# EAGLE schematic Radarv3 (EAGLE 6.3)
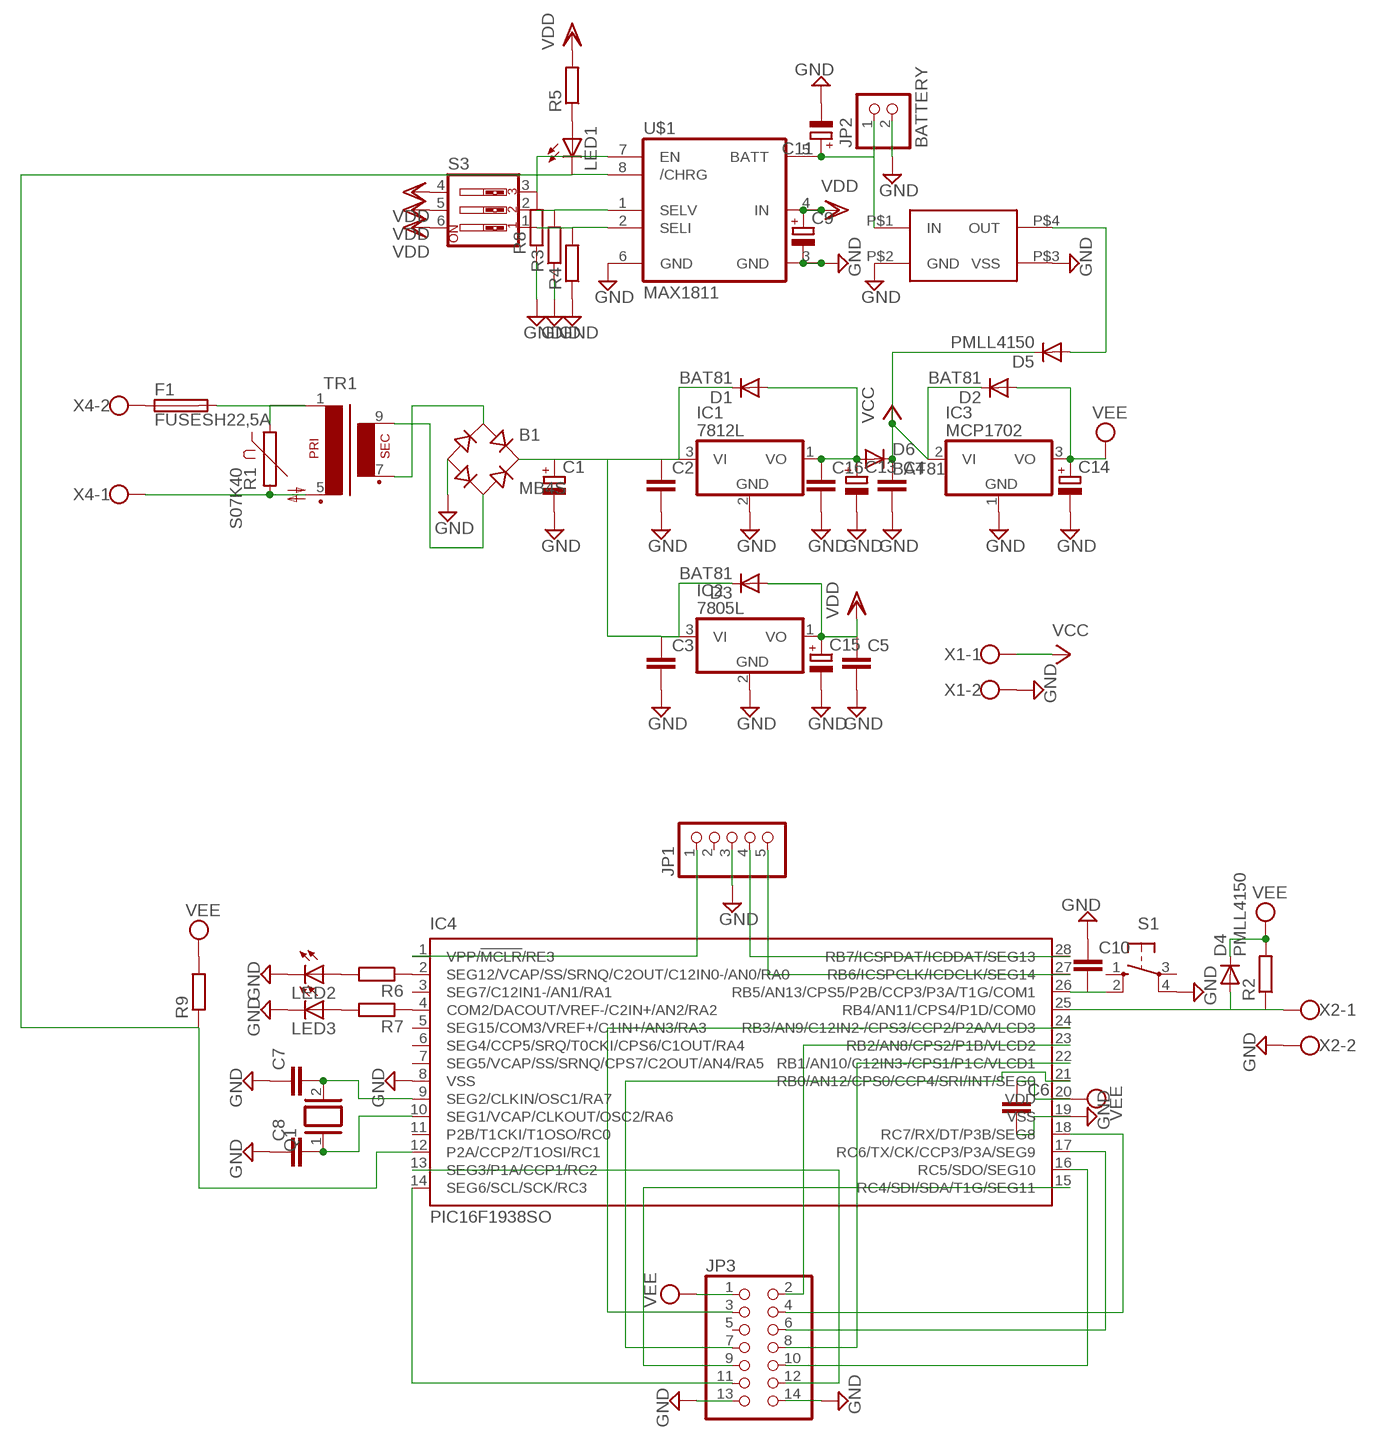
[diagram p0: schematic, sheet 1]

## Parts
B1  MB4S  [SOIC-4]
C1  CPOL-EUE3.5-10  [E3,5-10]
C2  C-EUC1206  [C1206]
C3  C-EUC1206  [C1206]
C4  C-EUC1206  [C1206]
C5  C-EUC1206  [C1206]
C6  C-EU025-030X050  [C025-030X050]
C7  C-EUC1206  [C1206]
C8  C-EUC1206  [C1206]
C9  CPOL-EUE2,5-6E  [E2,5-6E]
C10  C-EUC1206  [C1206]
C11  CPOL-EUE2,5-6E  [E2,5-6E]
C13  CPOL-EUE2,5-6E  [E2,5-6E]
C14  CPOL-EUE2,5-6E  [E2,5-6E]
C15  CPOL-EUE2,5-6E  [E2,5-6E]
C16  C-EUC1206  [C1206]
D1  BAT81  [DO34-7]
D2  BAT81  [DO34-7]
D3  BAT81  [DO34-7]
D4  PMLL4150  [SOD80C]
D5  PMLL4150  [SOD80C]
D6  BAT81  [DO34-7]
F1  FUSESH22,5A  [SH22,5A]
IC1  7812L  [TO92]
IC2  7805L  [TO92]
IC3  MCP1702  [TO-92]
IC4  PIC16F1938SO  [SO28W]
JP1  PINHD-1X5  [1X05]
JP2  BATTERY  PINHD-1X2  [1X02]
JP3  PINHD-2X7  [2X07]
LED1  LED3MM  [LED3MM]
LED2  LED3MM  [LED3MM]
LED3  LED3MM  [LED3MM]
Q1  XTAL/S  [QS]
R1  S07K40  [S07K40]
R2  R-EU_M1206  [M1206]
R3  R-EU_M1206  [M1206]
R4  R-EU_M1206  [M1206]
R5  R-EU_M1206  [M1206]
R6  R-EU_M1206  [M1206]
R7  R-EU_M1206  [M1206]
R8  R-EU_M1206  [M1206]
R9  R-EU_M1206  [M1206]
S1  10-XX  [B3F-10XX]
S3  SW_DIP-3  [EDG-03]
TR1  VV11  [VV11]
U$1  MAX1811  [SO08]
U$2  STEP_UP_MODULE  [STEP_UP_MOD]
X1  W237-102  [W237-102]
X2  W237-102  [W237-102]
X4  W237-102  [W237-102]

## Nets
CHG_LOGIC_OUT: IC4.12(P2A/CCP2/T1OSI/RC1) LED1.K(C) R9.1 U$1.8(/CHRG)
GND: B1.- C1.- C2.2 C3.2 C4.2 C5.2 C6.2 C7.1 C8.1 C9.- C10.1 C11.- C13.- C14.- C15.- C16.2 IC1.2(GND) IC2.2(GND) IC3.1(GND) IC4.8(VSS) IC4.19(VSS) JP1.3 JP2.2 JP3.13 JP3.14 LED2.K(C) LED3.K(C) R3.1 R4.1 R8.1 S1.4(P1) U$1.3(GND) U$1.6(GND) U$2.P$2(GND) U$2.P$3(VSS) X1.2 X2.2
N$1: F1.1 X4.2
N$2: F1.2 R1.1 TR1.1
N$3: R1.2 TR1.5(P2) X4.1
N$4: B1.~2(AC2) TR1.9(S4)
N$5: B1.~1(AC1) TR1.7(S3)
N$6: C7.2 IC4.9(SEG2/CLKIN/OSC1/RA7) Q1.2
N$7: C8.2 IC4.10(SEG1/VCAP/CLKOUT/OSC2/RA6) Q1.1
N$8: B1.+ C1.+ C2.1 C3.1 D1.C D3.C IC1.3(VI) IC2.3(VI)
N$9: D4.A IC4.25(RB4/AN11/CPS4/P1D/COM0) R2.1 X2.1
N$10: LED1.A R5.1
N$11: C10.2 IC4.26(RB5/AN13/CPS5/P2B/CCP3/P3A/T1G/COM1) S1.2(S1)
N$12: IC4.1(VPP/!MCLR!/RE3) JP1.1
N$13: IC4.27(RB6/ICSPCLK/ICDCLK/SEG14) JP1.5
N$14: IC4.28(RB7/ICSPDAT/ICDDAT/SEG13) JP1.4
N$15: R8.2 S3.3 U$1.7(EN)
N$16: R3.2 S3.2 U$1.1(SELV)
N$17: R4.2 S3.1 U$1.2(SELI)
N$18: C13.+ C16.1 D1.A D6.A IC1.1(VO)
N$19: IC4.2(SEG12/VCAP/SS/SRNQ/C2OUT/C12IN0-/AN0/RA0) R6.1
N$20: IC4.4(COM2/DACOUT/VREF-/C2IN+/AN2/RA2) R7.1
N$21: LED2.A R6.2
N$22: LED3.A R7.2
N$23: IC4.14(SEG6/SCL/SCK/RC3) JP3.11
N$24: C11.+ JP2.1 U$1.5(BATT) U$2.P$1(IN)
N$25: IC4.16(RC5/SDO/SEG10) JP3.10
N$26: IC4.15(RC4/SDI/SDA/T1G/SEG11) JP3.9
N$27: IC4.21(RB0/AN12/CPS0/CCP4/SRI/INT/SEG0) JP3.7
N$28: IC4.22(RB1/AN10/C12IN3-/CPS1/P1C/VLCD1) JP3.8
N$29: IC4.13(SEG3/P1A/CCP1/RC2) JP3.12
N$30: IC4.17(RC6/TX/CK/CCP3/P3A/SEG9) JP3.6
N$31: IC4.18(RC7/RX/DT/P3B/SEG8) JP3.4
N$32: IC4.23(RB2/AN8/CPS2/P1B/VLCD2) JP3.2
N$33: IC4.24(RB3/AN9/C12IN2-/CPS3/CCP2/P2A/VLCD3) JP3.3
N$35: D5.A U$2.P$4(OUT)
VCC: C4.1 D2.C D5.C D6.C IC3.2(VI) X1.1
VDD: C5.1 C9.+ C15.+ D3.A IC2.1(VO) R5.2 S3.4 S3.5 S3.6 U$1.4(IN)
VEE: C6.1 C14.+ D2.A D4.C IC3.3(VO) IC4.20(VDD) JP3.1 R2.2 R9.2
Unconnected: IC4.3(SEG7/C12IN1-/AN1/RA1) IC4.5(SEG15/COM3/VREF+/C1IN+/AN3/RA3) IC4.6(SEG4/CCP5/SRQ/T0CKI/CPS6/C1OUT/RA4) IC4.7(SEG5/VCAP/SS/SRNQ/CPS7/C2OUT/AN4/RA5) IC4.11(P2B/T1CKI/T1OSO/RC0) JP1.2 JP3.5 S1.1(S) S1.3(P)

## Library data of the parts
B1 = rectifier:MB*S: Bridge Rectifier Source: http://www.fairchildsemi.com/ds/MB/MB6S.pdf
C1 C9 C11 C13-C15 = rcl:CPOL-EU: POLARIZED CAPACITOR, European symbol
C2-C5 C7 C8 C10 C16 = resistor:C-EU: CAPACITOR, European symbol
C6 = rcl:C-EU: CAPACITOR, European symbol
D1-D3 D6 = diode:BAT81: DIODE barrier diode
D4 D5 = diode:PMLL4150: DIODE high speed
F1 = fuse:FUSE: Fuse; OC_FARNELL: unknown; OC_NEWARK: unknown
IC1 IC2 = linear:78*: Positive VOLTAGE REGULATOR Source: http://cache.national.com/ds/LM/LM78L05.pdf http://www.fairchildsemi.com/ds/LM/LM7805.pdf
IC3 = Panos:MCP1702
IC4 = microchip:PIC16F19*: Flash-Based, 8-Bit CMOS Microcontrollers wtih LCD Driver and nanoWatt XLP Technology Auto generated by make-symbol-device-package-bsdl.ulp Rev. 33 Source: http://ww1.microchip.com/downloads/en/DeviceDoc/41364D.pdf; MPN: PIC16F1938-I/SO; OC_FARNELL: 1755828; OC_NEWARK: 08R1948
JP1 = pinhead:PINHD-1X5: PIN HEADER
JP2 = pinhead:PINHD-1X2: PIN HEADER
JP3 = pinhead:PINHD-2X7: PIN HEADER
LED1-LED3 = led:LED: LED OSRAM: - CHIPLED LG R971, LG N971, LY N971, LG Q971, LY Q971, LO R971, LY R971 LH N974, LH R974 LS Q976, LO Q976, LY Q976 LO Q996 - Hyper CHIPLED LW Q18S LB Q993, LB Q99A, LB R99A - SideLED LS A670, LO A670, LY A670, LG A670, LP A670 LB A673, LV A673, LT A673, LW A673 LH A674 LY A675 LS A676, LA A676, LO A676, LY A676, LW A676 LS A679, LY A679, LG A679 - Hyper Micro SIDELED® LS Y876, LA Y876, LO Y876, LY Y876 LT Y87S - SmartLED LW L88C, LW L88S LB L89C, LB L89S, LG L890 LS L89K, LO L89K, LY L89K LS L896, LA L896, LO L896, LY L896 - TOPLED LS T670, LO T670, LY T670, LG T670, LP T670 LSG T670, LSP T670, LSY T670, LOP T670, LYG T670 LG T671, LOG T671, LSG T671 LB T673, LV T673, LT T673, LW T673 LH T674 LS T676, LA T676, LO T676, LY T676, LB T676, LH T676, LSB T676, LW T676 LB T67C, LV T67C, LT T67C, LS T67K, LO T67K, LY T67K, LW E67C LS E67B, LA E67B, LO E67B, LY E67B, LB E67C, LV E67C, LT E67C LW T67C LS T679, LY T679, LG T679 LS T770, LO T770, LY T770, LG T770, LP T770 LB T773, LV T773, LT T773, LW T773 LH T774 LS E675, LA E675, LY E675, LS T675 LS T776, LA T776, LO T776, LY T776, LB T776 LHGB T686 LT T68C, LB T68C - Hyper Mini TOPLED® LB M676 - Mini TOPLED Santana® LG M470 LS M47K, LO M47K, LY M47K Source: http://www.osram.convergy.de LUXEON: - LUMILED® LXK2-PW12-R00, LXK2-PW12-S00, LXK2-PW14-U00, LXK2-PW14-V00 LXK2-PM12-R00, LXK2-PM12-S00, LXK2-PM14-U00 LXK2-PE12-Q00, LXK2-PE12-R00, LXK2-PE12-S00, LXK2-PE14-T00, LXK2-PE14-U00 LXK2-PB12-K00, LXK2-PB12-L00, LXK2-PB12-M00, LXK2-PB14-N00, LXK2-PB14-P00, LXK2-PB14-Q00 LXK2-PR12-L00, LXK2-PR12-M00, LXK2-PR14-Q00, LXK2-PR14-R00 LXK2-PD12-Q00, LXK2-PD12-R00, LXK2-PD12-S00 LXK2-PH12-R00, LXK2-PH12-S00 LXK2-PL12-P00, LXK2-PL12-Q00, LXK2-PL12-R00 Source: www.luxeon.com KINGBRIGHT: KA-3528ASYC Source: www.kingbright.com
Q1 = special:XTAL/S: CRYSTAL
R1 = varistor:S07K40: VARISTOR
R2-R9 = resistor:R-EU_: RESISTOR, European symbol
S1 = switch-omron:10-XX: OMRON SWITCH; MPN: B3F-1000; OC_FARNELL: 176432; OC_NEWARK: 36M3542
S3 = special:SW_DIP-3: DIP SWITCH
TR1 = trafo:VV11: TRANSFORMER 1 primary winding, 1 secondary winding BLOCK
U$1 = max1811:MAX1811
U$2 = step_up_mod:STEP_UP_MODULE
X1 X2 X4 = con-wago-500:W237-102: WAGO SCREW CLAMP; MPN: 237-102; OC_FARNELL: unknown; OC_NEWARK: 70K9898